# Altium schematic sheet PowerClocks.SCHDOC
size B
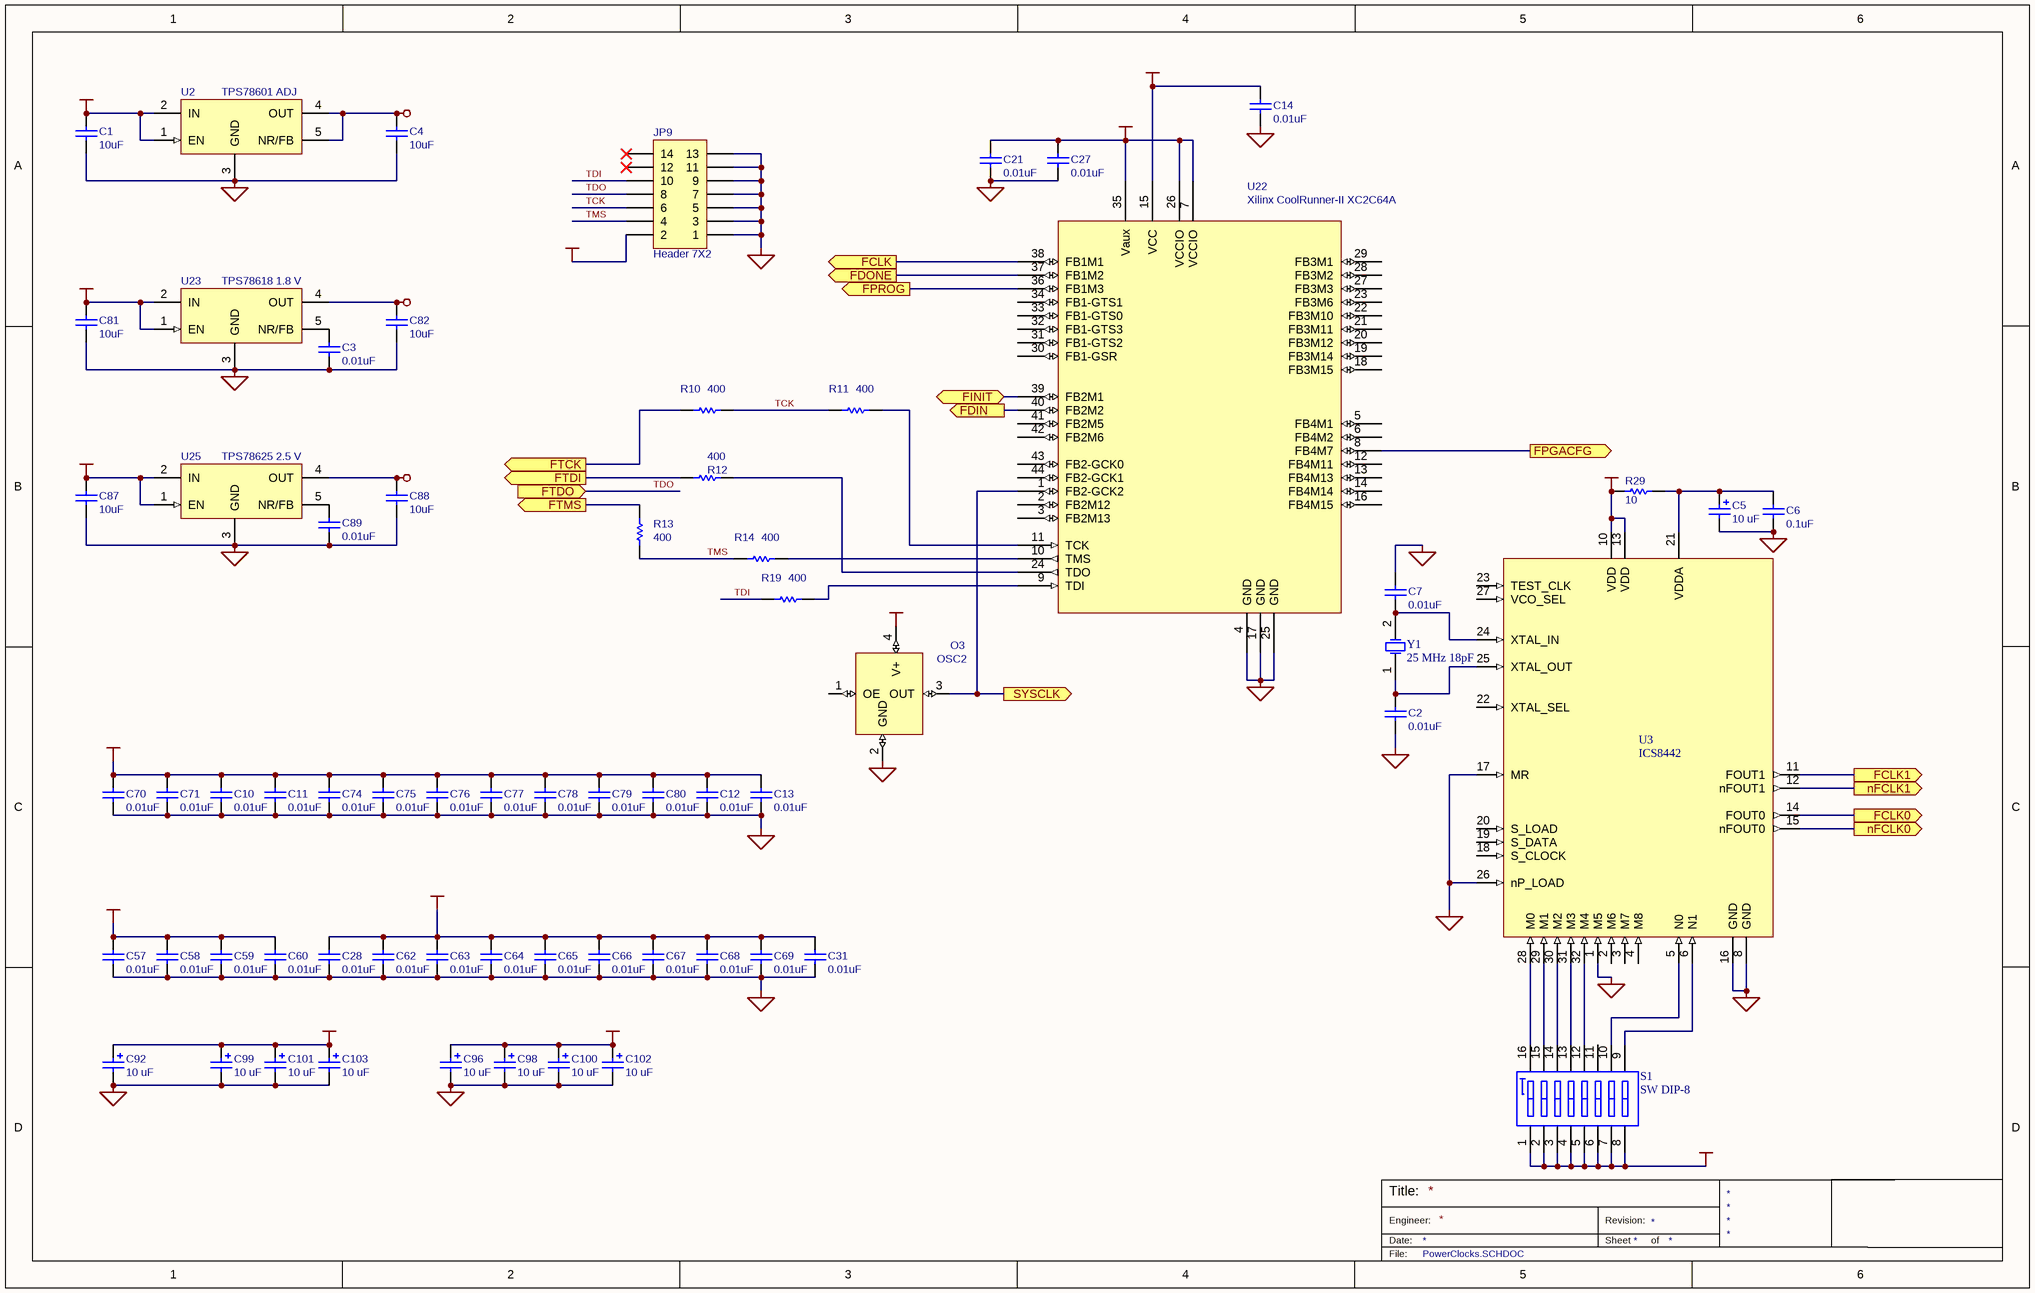
[diagram p0: PowerClocks.SCHDOC]

## Parts
C1  10uF  [CC3216-1206]
C2  value 0.01uF  [CC1005-0402]  (hidden comment: Cap)
C3  value 0.01uF  [CC1005-0402]  (hidden comment: Cap)
C4  10uF  [CC3216-1206]
C5  value 10 uF  [TC3528-1411]  (hidden comment: Bypass Cap)
C6  value 0.1uF  [CC1005-0402]  (hidden comment: Cap)
C7  value 0.01uF  [CC1005-0402]  (hidden comment: Cap)
C10  value 0.01uF  [CC1005-0402]  (hidden comment: Cap)
C11  value 0.01uF  [CC1005-0402]  (hidden comment: Cap)
C12  value 0.01uF  [CC1005-0402]  (hidden comment: Cap)
C13  value 0.01uF  [CC1005-0402]  (hidden comment: Cap)
C14  value 0.01uF  [CC1005-0402]  (hidden comment: Cap)
C21  value 0.01uF  [CC1005-0402]  (hidden comment: Cap)
C27  value 0.01uF  [CC1005-0402]  (hidden comment: Cap)
C28  value 0.01uF  [CC1005-0402]  (hidden comment: Cap)
C31  value 0.01uF  [CC1005-0402]  (hidden comment: Cap)
C57  value 0.01uF  [CC1005-0402]  (hidden comment: Cap)
C58  value 0.01uF  [CC1005-0402]  (hidden comment: Cap)
C59  value 0.01uF  [CC1005-0402]  (hidden comment: Cap)
C60  value 0.01uF  [CC1005-0402]  (hidden comment: Cap)
C62  value 0.01uF  [CC1005-0402]  (hidden comment: Cap)
C63  value 0.01uF  [CC1005-0402]  (hidden comment: Cap)
C64  value 0.01uF  [CC1005-0402]  (hidden comment: Cap)
C65  value 0.01uF  [CC1005-0402]  (hidden comment: Cap)
C66  value 0.01uF  [CC1005-0402]  (hidden comment: Cap)
C67  value 0.01uF  [CC1005-0402]  (hidden comment: Cap)
C68  value 0.01uF  [CC1005-0402]  (hidden comment: Cap)
C69  value 0.01uF  [CC1005-0402]  (hidden comment: Cap)
C70  value 0.01uF  [CC1005-0402]  (hidden comment: Cap)
C71  value 0.01uF  [CC1005-0402]  (hidden comment: Cap)
C74  value 0.01uF  [CC1005-0402]  (hidden comment: Cap)
C75  value 0.01uF  [CC1005-0402]  (hidden comment: Cap)
C76  value 0.01uF  [CC1005-0402]  (hidden comment: Cap)
C77  value 0.01uF  [CC1005-0402]  (hidden comment: Cap)
C78  value 0.01uF  [CC1005-0402]  (hidden comment: Cap)
C79  value 0.01uF  [CC1005-0402]  (hidden comment: Cap)
C80  value 0.01uF  [CC1005-0402]  (hidden comment: Cap)
C81  10uF  [CC3216-1206]
C82  10uF  [CC3216-1206]
C87  10uF  [CC3216-1206]
C88  10uF  [CC3216-1206]
C89  value 0.01uF  [CC1005-0402]  (hidden comment: Cap)
C92  value 10 uF  [TC3528-1411]  (hidden comment: Bypass Cap)
C96  value 10 uF  [TC3528-1411]  (hidden comment: Bypass Cap)
C98  value 10 uF  [TC3528-1411]  (hidden comment: Bypass Cap)
C99  value 10 uF  [TC3528-1411]  (hidden comment: Bypass Cap)
C100  value 10 uF  [TC3528-1411]  (hidden comment: Bypass Cap)
C101  value 10 uF  [TC3528-1411]  (hidden comment: Bypass Cap)
C102  value 10 uF  [TC3528-1411]  (hidden comment: Bypass Cap)
C103  value 10 uF  [TC3528-1411]  (hidden comment: Bypass Cap)
JP9  Header 7X2  [HDR2x7-2mm]
O3  OSC2  [ECS-3953M]
R10  value 400  [CR1608-0603]  (hidden comment: current-limiting series res)
R11  value 400  [CR1608-0603]  (hidden comment: current-limiting series res)
R12  value 400  [CR1608-0603]  (hidden comment: current-limiting series res)
R13  value 400  [CR1608-0603]  (hidden comment: current-limiting series res)
R14  value 400  [CR1608-0603]  (hidden comment: current-limiting series res)
R19  value 400  [CR1608-0603]  (hidden comment: current-limiting series res)
R29  value 10  [CR1608-0603]  (hidden comment: Res1)
S1  SW DIP-8  [CANNON-SDA]
U2  TPS78601 ADJ  [KTT]
U3  ICS8442  [QFP7x7-G32/N]
U22  Xilinx CoolRunner-II XC2C64A  [QFP10x10-G44/G10N]
U23  TPS78618 1.8 V  [KTT]
U25  TPS78625 2.5 V  [KTT]
Y1  25 MHz 18pF  [ECS CSM-7]

## Ports
FCLK0 (out), FCLK1 (out), FCLK (out), FDIN (out), FDONE (out), FINIT (bidir), FPGACFG (out), FPROG (out), FTCK (out), FTDI (out), FTDO (in), FTMS (out), nFCLK0 (out), nFCLK1 (out), SYSCLK (out)

## Nets
+1.2VCC: C4.2 C57.2 C58.2 C59.2 C60.2 C96.1 C98.1 C100.1 C102.1 U2.4(OUT) U2.5(NR/FB)
+1.8VCC: C14.2 C82.2 U22.15(VCC) U23.4(OUT)
+2.5VCC: C28.2 C31.2 C62.2 C63.2 C64.2 C65.2 C66.2 C67.2 C68.2 C69.2 C88.2 U25.4(OUT)
GND: C1.1 C2.1 C3.2 C4.1 C5.2 C6.1 C7.2 C10.1 C11.1 C12.1 C13.1 C14.1 C21.1 C27.1 C28.1 C31.1 C57.1 C58.1 C59.1 C60.1 C62.1 C63.1 C64.1 C65.1 C66.1 C67.1 C68.1 C69.1 C70.1 C71.1 C74.1 C75.1 C76.1 C77.1 C78.1 C79.1 C80.1 C81.1 C82.1 C87.1 C88.1 C89.2 C92.2 C96.2 C98.2 C99.2 C100.2 C101.2 C102.2 C103.2 JP9.1 JP9.3 JP9.5 JP9.7 JP9.9 JP9.11 JP9.13 O3.2(GND) U2.3(GND) U3.1(M5) U3.8(GND) U3.16(GND) U3.17(MR) U3.26(nP_LOAD) U22.4(GND) U22.17(GND) U22.25(GND) U23.3(GND) U25.3(GND)
VCC: C1.2 C10.2 C11.2 C12.2 C13.2 C21.2 C27.2 C70.2 C71.2 C74.2 C75.2 C76.2 C77.2 C78.2 C79.2 C80.2 C81.2 C87.2 C92.1 C99.1 C101.1 C103.1 JP9.2 O3.4(V+) R29.1 S1.1(A1) S1.2(A2) S1.3(A3) S1.4(A4) S1.5(A5) S1.6(A6) S1.7(A7) S1.8(A8) U2.1(EN) U2.2(IN) U3.10(VDD) U3.13(VDD) U22.7(VCCIO) U22.26(VCCIO) U22.35(Vaux) U23.1(EN) U23.2(IN) U25.1(EN) U25.2(IN)
FCLK: U22.38(FB1M1) ; port FCLK
FCLK0: U3.14(FOUT0) ; port FCLK0
FCLK1: U3.11(FOUT1) ; port FCLK1
FDIN: U22.40(FB2M2) ; port FDIN
FDONE: U22.37(FB1M2) ; port FDONE
FINIT: U22.39(FB2M1) ; port FINIT
FPGACFG: U22.8(FB4M7) ; port FPGACFG
FPROG: U22.36(FB1M3) ; port FPROG
FTCK: R10.2 ; port FTCK
FTDI: R12.2 ; port FTDI
FTMS: R13.1 ; port FTMS
nFCLK0: U3.15(nFOUT0) ; port nFCLK0
nFCLK1: U3.12(nFOUT1) ; port nFCLK1
SYSCLK: O3.3(OUT) U22.1(FB2-GCK2) ; port SYSCLK
TCK: JP9.6 R10.1 R11.2
TDI: JP9.10 R19.2
TDO: JP9.8 ; port FTDO
TMS: JP9.4 R13.2 R14.2
NetC2_2: C2.2 U3.25(XTAL_OUT) Y1.1(OSC1)
NetC3_1: C3.1 U23.5(NR/FB)
NetC5_1: C5.1 C6.2 R29.2 U3.21(VDDA)
NetC7_1: C7.1 U3.24(XTAL_IN) Y1.2(OSC2)
NetC89_1: C89.1 U25.5(NR/FB)
NetR11_1: R11.1 U22.11(TCK)
NetR12_1: R12.1 U22.24(TDO)
NetR14_1: R14.1 U22.10(TMS)
NetR19_1: R19.1 U22.9(TDI)
NetS1_9: S1.9(B8) U3.6(N1)
NetS1_10: S1.10(B7) U3.5(N0)
NetS1_12: S1.12(B5) U3.32(M4)
NetS1_13: S1.13(B4) U3.31(M3)
NetS1_14: S1.14(B3) U3.30(M2)
NetS1_15: S1.15(B2) U3.29(M1)
NetS1_16: S1.16(B1) U3.28(M0)

Not connected (* = marked no-connect by the designer): JP9 12* 14*; O3 1(OE); S1 11(B6); U3 2(M6) 3(M7) 4(M8) 18(S_CLOCK) 19(S_DATA) 20(S_LOAD) 22(XTAL_SEL) 23(TEST_CLK) 27(VCO_SEL); U22 2(FB2M12) 3(FB2M13) 5(FB4M1) 6(FB4M2) 12(FB4M11) 13(FB4M13) 14(FB4M14) 16(FB4M15) 18(FB3M15) 19(FB3M14) 20(FB3M12) 21(FB3M11) 22(FB3M10) 23(FB3M6) 27(FB3M3) 28(FB3M2) 29(FB3M1) 30(FB1-GSR) 31(FB1-GTS2) 32(FB1-GTS3) 33(FB1-GTS0) 34(FB1-GTS1) 41(FB2M5) 42(FB2M6) 43(FB2-GCK0) 44(FB2-GCK1)

## Notes on the sheet
- Title:
- Engineer:
- Date:
- Revision:
- Sheet
- of
- File:

## Library data of the parts
C1 C3 C4 C81 C82 C87-C89 = Cap: Capacitor; Published: 8-Jun-2000; LatestRevisionDate: 17-Jul-2002; LatestRevisionNote: Re-released for DXP Platform.; Publisher: Altium Limited
C2 C6 C7 C10-C14 C21 C27 C28 C31 C57-C60 C62-C71 C74-C80 = Cap: Capacitor; Manufacturer: Generic Components; Class I: Passive; Published: 8-Jun-2000; Revision: July-2002: Re-released for DXP Platform.; Publisher: Altium Limited; Class II: Capacitor
C5 C92 C96 C98-C103 = Cap Pol3: Tantalum Bypass cap; Manufacturer: Generic Components; Class I: Passive; Class II: Capacitor; Published: 8-Jun-2000; Revision: July-2002: Re-released for DXP Platform.; Publisher: Altium Limited
JP9 = Header 7X2: Header, 7-Pin, Dual row; Manufacturer: Generic Components; Class I: Connector; Vendor: MOLEX 87831-1420; Revision: July-2002: Re-released for DXP Platform.; Publisher: Altium Limited
O3 = OSC2: ECS SMD Oscillator, ECS-3953M
R10-R14 R19 R29 = Res1: Resistor; Manufacturer: Generic Components; Class I: Passive; Published: 8-Jun-2000; Revision: July-2002: Re-released for DXP Platform.; Publisher: Altium Limited; Class II: Resistor
S1 = SW DIP-8: DIP Switch, 8 Position, SPST; Published: 24-Mar-1999; LatestRevisionDate: 17-Jul-2002; LatestRevisionNote: Re-released for DXP Platform.; Publisher: Altium Limited
U2 U23 U25 = TPS786XX: TI 1.5A LDO
U3 = ICS8442: 700 MHx Crystal Oscillator-todifferential LVDS Freq Synth
U22 = XC2C64A-5VQ44C
Y1 = XTAL: Crystal Oscillator; Published: 8-Jun-2000; LatestRevisionDate: 17-Jul-2002; LatestRevisionNote: Re-released for DXP Platform.; PackageReference: R38; Publisher: Altium Limited